# EAGLE design bombhonor (EAGLE 9.5.2)
DATABASE: D:\Alma Automotive s.r.l\Library - Eagle-LIB\database\almadb.txt
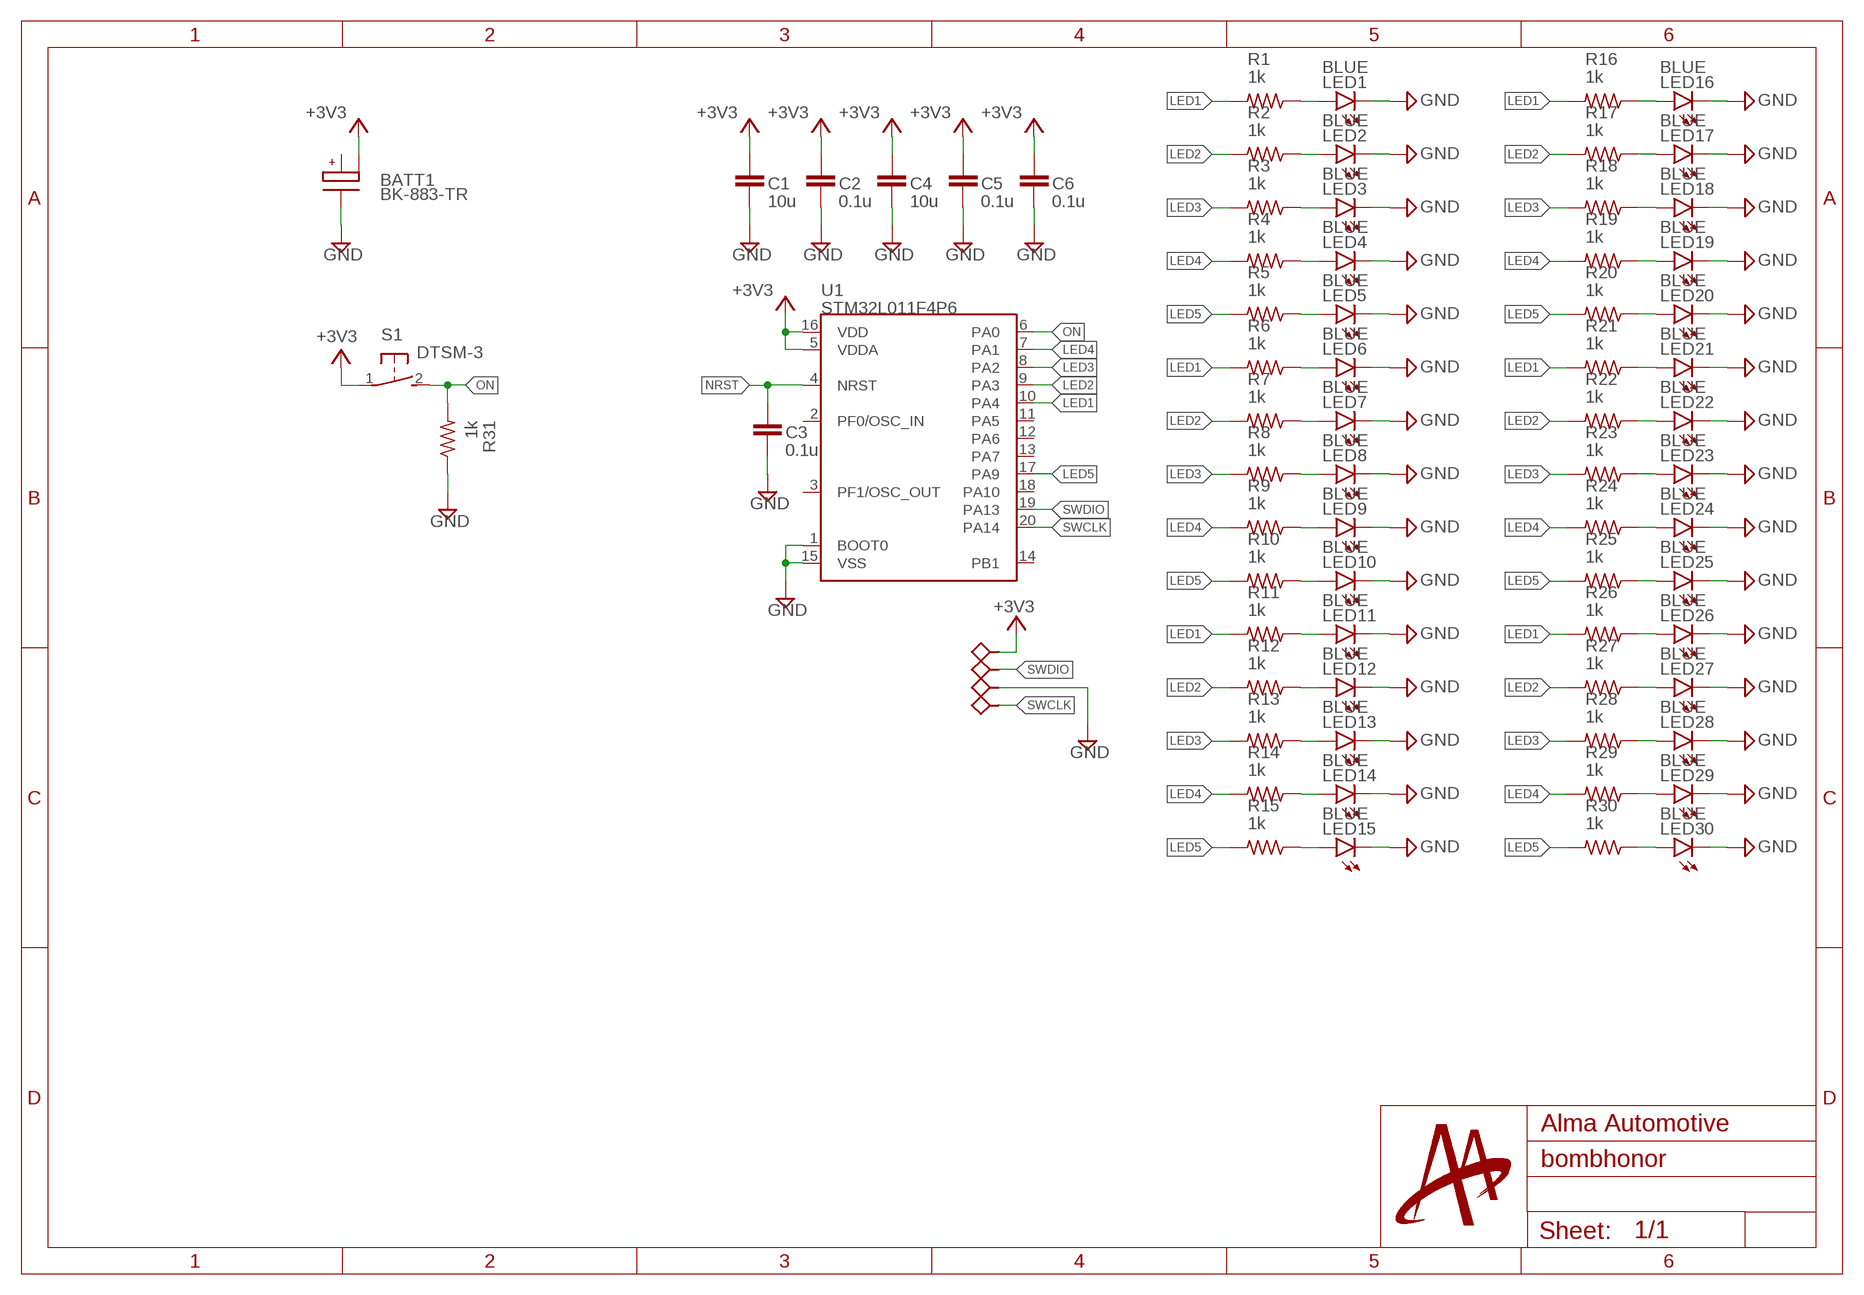
[diagram p0: schematic, sheet 1]

## Parts
BATT1  BK-883-TR  [BK-883-TR]
C1  10u  C0805  [0805[2012]]
C2  0.1u  C0603  [0603[1608]]
C3  0.1u  C0603  [0603[1608]]
C4  10u  C0805  [0805[2012]]
C5  0.1u  C0603  [0603[1608]]
C6  0.1u  C0603  [0603[1608]]
LED1  BLUE  LED_SMD1206  [1206[3216]BOTTOM_ENTRY]
LED2  BLUE  LED_SMD1206  [1206[3216]BOTTOM_ENTRY]
LED3  BLUE  LED_SMD1206  [1206[3216]BOTTOM_ENTRY]
LED4  BLUE  LED_SMD1206  [1206[3216]BOTTOM_ENTRY]
LED5  BLUE  LED_SMD1206  [1206[3216]BOTTOM_ENTRY]
LED6  BLUE  LED_SMD1206  [1206[3216]BOTTOM_ENTRY]
LED7  BLUE  LED_SMD1206  [1206[3216]BOTTOM_ENTRY]
LED8  BLUE  LED_SMD1206  [1206[3216]BOTTOM_ENTRY]
LED9  BLUE  LED_SMD1206  [1206[3216]BOTTOM_ENTRY]
LED10  BLUE  LED_SMD1206  [1206[3216]BOTTOM_ENTRY]
LED11  BLUE  LED_SMD1206  [1206[3216]BOTTOM_ENTRY]
LED12  BLUE  LED_SMD1206  [1206[3216]BOTTOM_ENTRY]
LED13  BLUE  LED_SMD1206  [1206[3216]BOTTOM_ENTRY]
LED14  BLUE  LED_SMD1206  [1206[3216]BOTTOM_ENTRY]
LED15  BLUE  LED_SMD1206  [1206[3216]BOTTOM_ENTRY]
LED16  BLUE  LED_SMD1206  [1206[3216]BOTTOM_ENTRY]
LED17  BLUE  LED_SMD1206  [1206[3216]BOTTOM_ENTRY]
LED18  BLUE  LED_SMD1206  [1206[3216]BOTTOM_ENTRY]
LED19  BLUE  LED_SMD1206  [1206[3216]BOTTOM_ENTRY]
LED20  BLUE  LED_SMD1206  [1206[3216]BOTTOM_ENTRY]
LED21  BLUE  LED_SMD1206  [1206[3216]BOTTOM_ENTRY]
LED22  BLUE  LED_SMD1206  [1206[3216]BOTTOM_ENTRY]
LED23  BLUE  LED_SMD1206  [1206[3216]BOTTOM_ENTRY]
LED24  BLUE  LED_SMD1206  [1206[3216]BOTTOM_ENTRY]
LED25  BLUE  LED_SMD1206  [1206[3216]BOTTOM_ENTRY]
LED26  BLUE  LED_SMD1206  [1206[3216]BOTTOM_ENTRY]
LED27  BLUE  LED_SMD1206  [1206[3216]BOTTOM_ENTRY]
LED28  BLUE  LED_SMD1206  [1206[3216]BOTTOM_ENTRY]
LED29  BLUE  LED_SMD1206  [1206[3216]BOTTOM_ENTRY]
LED30  BLUE  LED_SMD1206  [1206[3216]BOTTOM_ENTRY]
R1  1k  R0603  [0603[1608]]
R2  1k  R0603  [0603[1608]]
R3  1k  R0603  [0603[1608]]
R4  1k  R0603  [0603[1608]]
R5  1k  R0603  [0603[1608]]
R6  1k  R0603  [0603[1608]]
R7  1k  R0603  [0603[1608]]
R8  1k  R0603  [0603[1608]]
R9  1k  R0603  [0603[1608]]
R10  1k  R0603  [0603[1608]]
R11  1k  R0603  [0603[1608]]
R12  1k  R0603  [0603[1608]]
R13  1k  R0603  [0603[1608]]
R14  1k  R0603  [0603[1608]]
R15  1k  R0603  [0603[1608]]
R16  1k  R0603  [0603[1608]]
R17  1k  R0603  [0603[1608]]
R18  1k  R0603  [0603[1608]]
R19  1k  R0603  [0603[1608]]
R20  1k  R0603  [0603[1608]]
R21  1k  R0603  [0603[1608]]
R22  1k  R0603  [0603[1608]]
R23  1k  R0603  [0603[1608]]
R24  1k  R0603  [0603[1608]]
R25  1k  R0603  [0603[1608]]
R26  1k  R0603  [0603[1608]]
R27  1k  R0603  [0603[1608]]
R28  1k  R0603  [0603[1608]]
R29  1k  R0603  [0603[1608]]
R30  1k  R0603  [0603[1608]]
R31  1k  R0603  [0603[1608]]
S1  DTSM-3  [DTSM-3]
TP1  TESTPAD2MM  [TP-2MM]
TP2  TESTPAD2MM  [TP-2MM]
TP3  TESTPAD2MM  [TP-2MM]
TP4  TESTPAD2MM  [TP-2MM]
U1  STM32L011F4P6  STM32F030F4  [TSSOP20]

## Nets
+3V3: BATT1.V+2(V_BATT2) C1.1 C2.1 C4.1 C5.1 C6.1 S1.1 TP1.TP U1.5(VDDA) U1.16(VDD)
GND: BATT1.V-(GND) C1.2 C2.2 C3.2 C4.2 C5.2 C6.2 LED1.K LED2.K LED3.K LED4.K LED5.K LED6.K LED7.K LED8.K LED9.K LED10.K LED11.K LED12.K LED13.K LED14.K LED15.K LED16.K LED17.K LED18.K LED19.K LED20.K LED21.K LED22.K LED23.K LED24.K LED25.K LED26.K LED27.K LED28.K LED29.K LED30.K R31.1 TP3.TP U1.1(BOOT0) U1.15(VSS)
LED1: R1.2 R6.2 R11.2 R16.2 R21.2 R26.2 U1.10(PA4)
LED2: R2.2 R7.2 R12.2 R17.2 R22.2 R27.2 U1.9(PA3)
LED3: R3.2 R8.2 R13.2 R18.2 R23.2 R28.2 U1.8(PA2)
LED4: R4.2 R9.2 R14.2 R19.2 R24.2 R29.2 U1.7(PA1)
LED5: R5.2 R10.2 R15.2 R20.2 R25.2 R30.2 U1.17(PA9)
N$1: LED1.A R1.1
N$2: LED2.A R2.1
N$3: LED3.A R3.1
N$4: LED4.A R4.1
N$5: LED5.A R5.1
N$6: LED6.A R6.1
N$7: LED7.A R7.1
N$8: LED8.A R8.1
N$9: LED9.A R9.1
N$10: LED10.A R10.1
N$11: LED11.A R11.1
N$12: LED12.A R12.1
N$13: LED13.A R13.1
N$14: LED14.A R14.1
N$15: LED15.A R15.1
N$16: LED16.A R16.1
N$17: LED17.A R17.1
N$18: LED18.A R18.1
N$19: LED19.A R19.1
N$20: LED20.A R20.1
N$21: LED21.A R21.1
N$22: LED22.A R22.1
N$23: LED23.A R23.1
N$24: LED24.A R24.1
N$25: LED25.A R25.1
N$26: LED26.A R26.1
N$27: LED27.A R27.1
N$28: LED28.A R28.1
N$29: LED29.A R29.1
N$30: LED30.A R30.1
NRST: C3.1 U1.4(NRST)
ON: R31.2 S1.2 U1.6(PA0)
SWCLK: TP4.TP U1.20(PA14)
SWDIO: TP2.TP U1.19(PA13)
Unconnected: BATT1.V+1(V_BATT1) U1.2(PF0/OSC_IN) U1.3(PF1/OSC_OUT) U1.11(PA5) U1.12(PA6) U1.13(PA7) U1.14(PB1) U1.18(PA10)

## Library data of the parts
BATT1 = AlmaBATT:BK-883-TR; PARTNO: BK-883-TR
C1 C4 = AlmaPASS:C; PARTNO: CL21A106KQCLRNC
C2 C3 C5 C6 = AlmaPASS:C; PARTNO: CL10B104KB8NNNC
LED1-LED30 = AlmaOPTO:LED_SMD; PARTNO: LTST-C230TBKT
R1-R31 = AlmaPASS:R; PARTNO: RMCF0603JT1K00
S1 = switch-tact:DTSM-3; PARTNO: DTSM-3
TP1-TP4 = AlmaCONN:TESTPAD; DNP: T; PARTNO: DNP
U1 = AlmaIC:STM32F030F4; PARTNO: STM32L011F4P6

## Net classes
0 default: width 0.2 mm, drill 0.3 mm

## Board
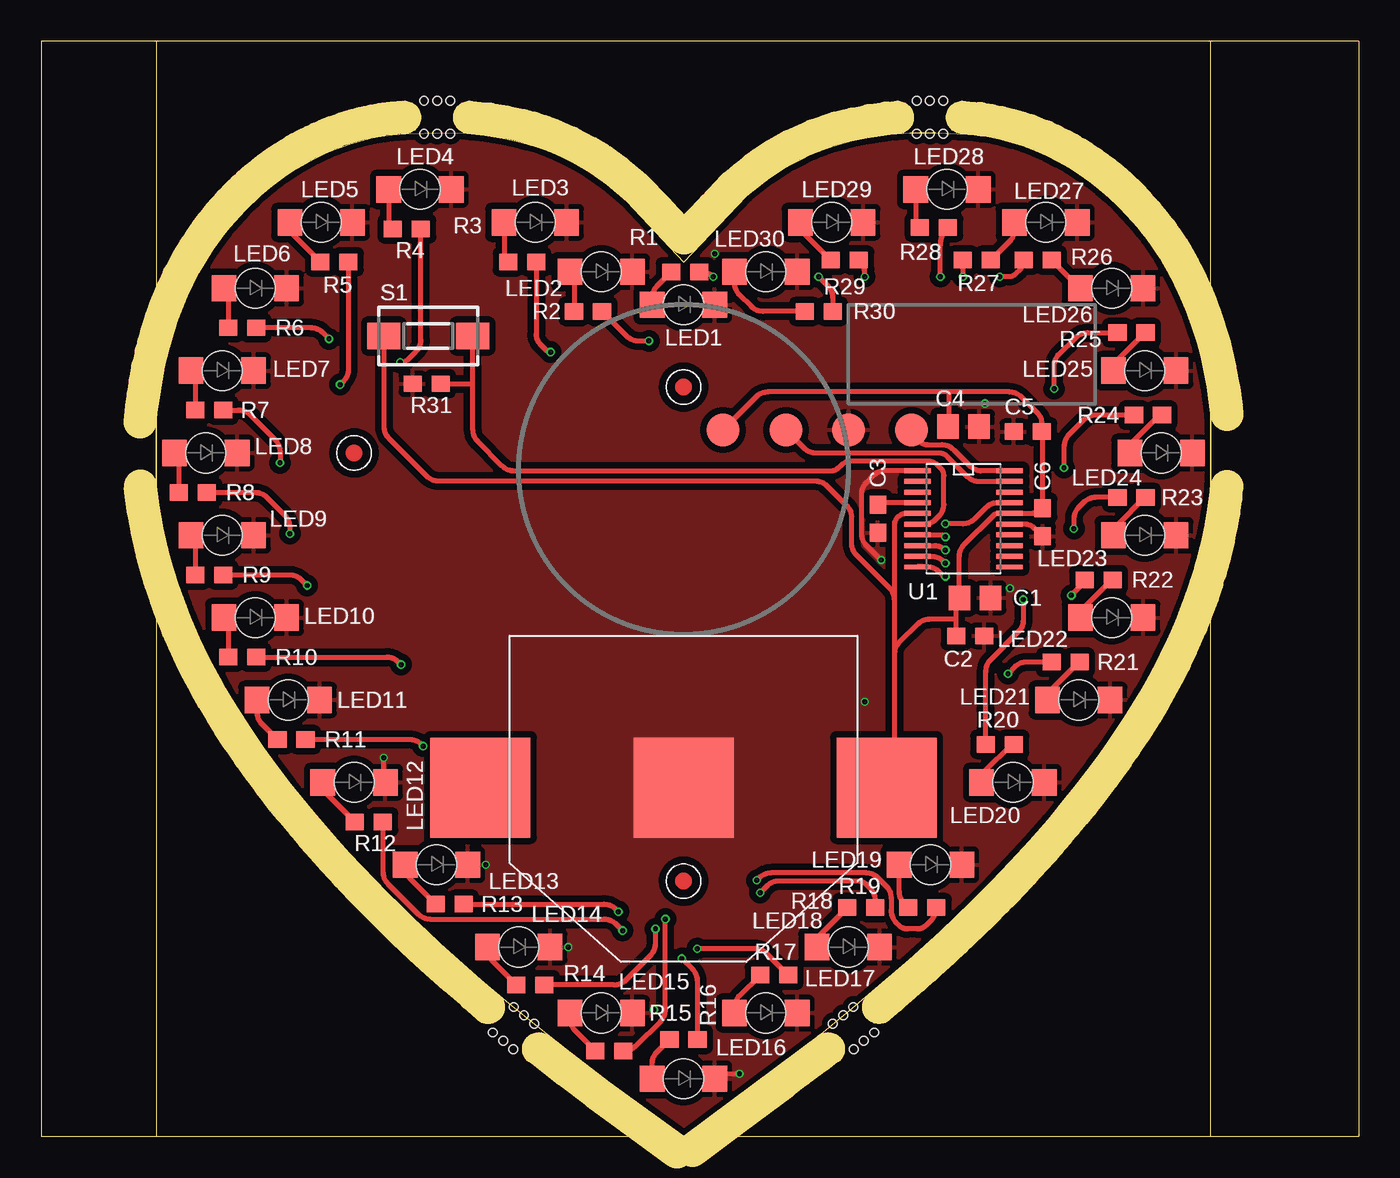
[diagram p1: board, top side]
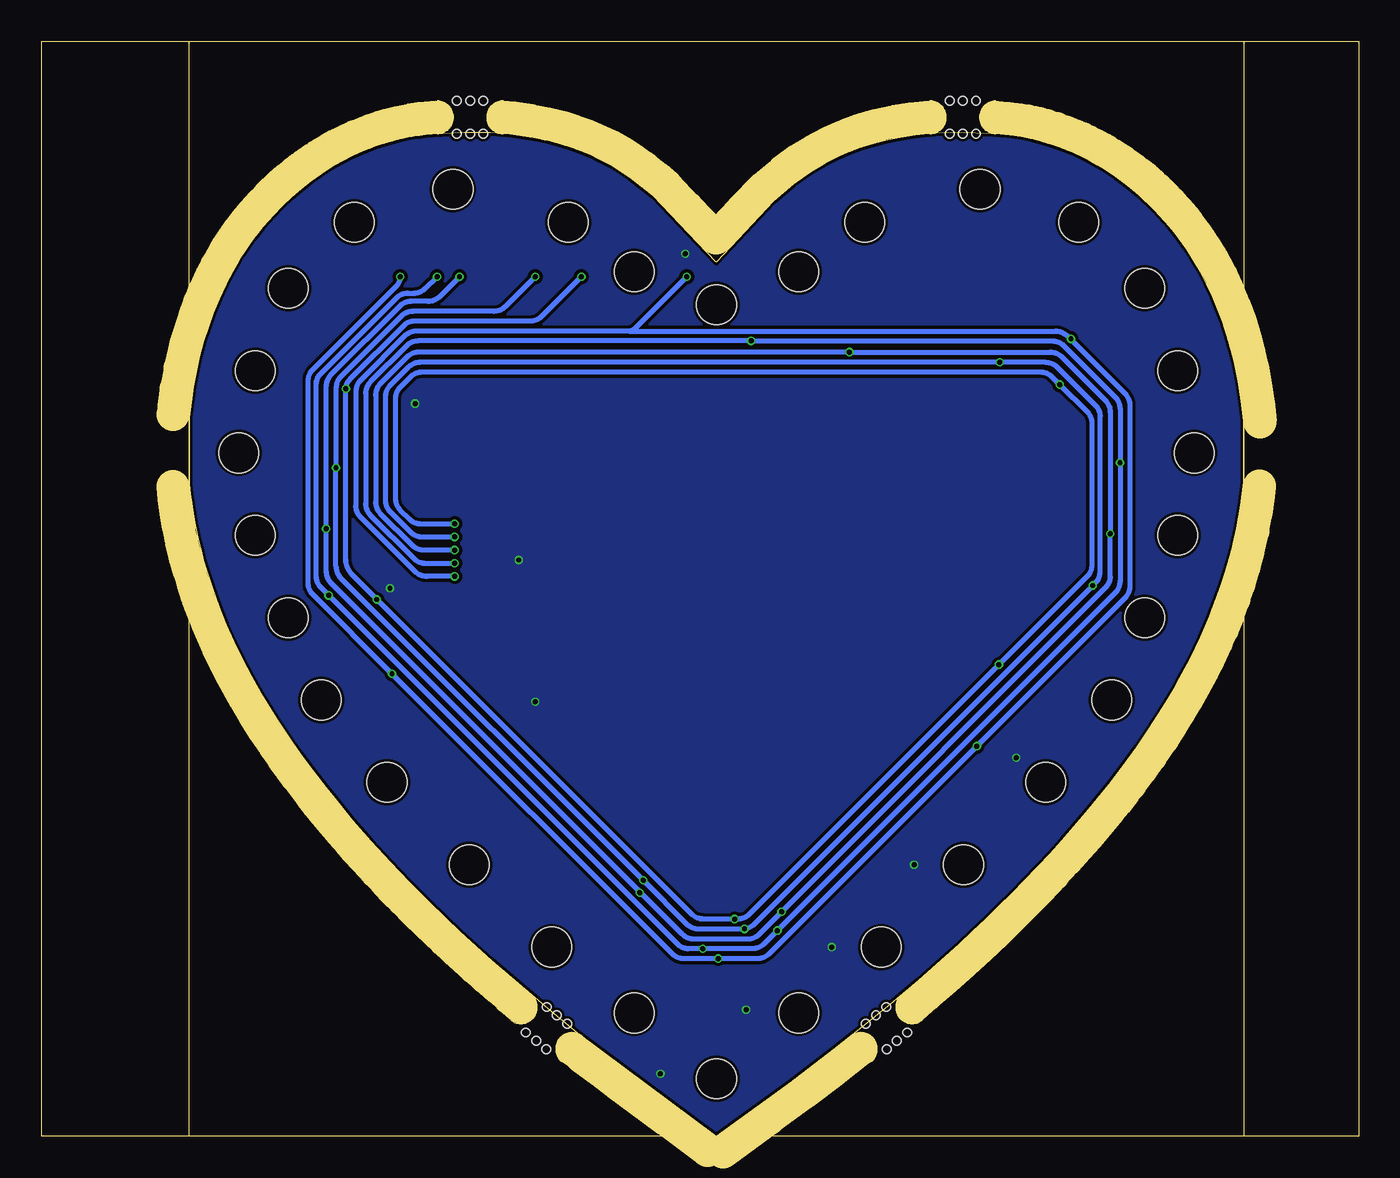
[diagram p2: board, bottom side, seen from below]

Size 80 x 66.5 mm. Coordinates in mm from the lower left corner, seen from the top.
Outline: 21.75,60.85 22.12,60.88 24.34,60.95 25.82,60.9 26.93,60.79 28.03,60.62 28.75,60.47 29.46,60.28 30.17,60.06 30.86,59.8 31.54,59.51 32.21,59.17 32.49,59.02 33.3,58.53 34.34,57.8 35.55,56.79 39.02,53.09 42.85,57.11 44.23,58.19 45.21,58.83 45.55,59.03 45.9,59.23 46.26,59.4 46.61,59.57 46.97,59.73 47.71,60.01 48.45,60.25 49.21,60.45 49.98,60.61 50.76,60.74 51.54,60.84 52.72,60.93 54.3,60.95 56.26,60.85 56.65,60.82 57.02,60.77 57.4,60.72 58.15,60.56 58.89,60.37 59.62,60.14 60.33,59.87 61.03,59.56 61.71,59.22 62.38,58.84 63.02,58.43 63.65,57.98 64.25,57.51 64.83,57.01 65.38,56.49 65.91,55.94 66.23,55.59 66.53,55.23 66.83,54.87 67.11,54.5 67.38,54.12 67.65,53.74 67.9,53.34 68.14,52.95 68.37,52.54 68.59,52.13 68.81,51.72 69.2,50.88 69.55,50.01 69.87,49.13 70.15,48.24 70.39,47.34 70.6,46.42 70.77,45.51 70.9,44.58 71,43.66 71,39.61 70.94,39.02 70.86,38.43 70.78,37.85 70.68,37.27 70.56,36.7 70.44,36.12 70.3,35.55 70.14,34.98 69.98,34.42 69.81,33.86 69.62,33.3 69.22,32.2 68.78,31.11 68.3,30.04 67.78,28.98 67.23,27.94 66.66,26.91 65.74,25.41 64.76,23.94 64.27,23.24 63.76,22.55 63.25,21.87 62.72,21.19 62.19,20.52 61.1,19.21 59.98,17.92 58.82,16.66 57.64,15.42 56.43,14.21 54.58,12.44 52.68,10.71 49.43,7.92 47.45,6.3 39.02,0 34.53,3.26 31.89,5.28 30.14,6.66 28.42,8.06 26.73,9.5 25.06,10.96 24.24,11.71 23.43,12.46 22.62,13.22 21.83,13.99 21.04,14.78 20.27,15.57 19.5,16.37 18.75,17.18 18,18 17.27,18.83 16.55,19.68 15.84,20.53 15.14,21.4 14.3,22.51 13.48,23.64 12.69,24.8 11.93,25.99 11.57,26.59 11.21,27.2 10.87,27.81 10.54,28.43 10.22,29.05 9.91,29.68 9.61,30.31 9.32,30.95 9.05,31.6 8.79,32.25 8.55,32.9 8.32,33.56 8.11,34.23 7.91,34.9 7.73,35.57 7.56,36.25 7.41,36.94 7.28,37.62 7.17,38.32 7.08,39.02 7,39.72 7,43.41 7.13,44.64 7.32,45.86 7.58,47.08 7.89,48.27 8.27,49.45 8.55,50.22 8.87,50.98 9.22,51.73 9.6,52.46 10.01,53.17 10.46,53.87 10.94,54.54 11.21,54.89 11.49,55.24 11.78,55.58 12.07,55.91 12.38,56.23 12.69,56.55 13.02,56.85 13.35,57.15 13.69,57.44 14.03,57.72 14.39,57.99 14.75,58.26 15.12,58.51 15.49,58.75 15.87,58.98 16.26,59.19 16.65,59.4 17.05,59.59 17.46,59.78 17.87,59.95 18.28,60.1 18.7,60.25 19.13,60.38 19.56,60.49 19.99,60.59 20.43,60.68 20.86,60.76 21.31,60.81 21.75,60.85
Outline: 0,0 80,0 80,66.5 0,66.5 0,0
Copper layers (1*16): Top 0.018mm / dielectric 1.55mm / Bottom 0.018mm
Design rules "ALLPCB *": minimum track width 0.3mm, minimum drill 0.3mm, track to track 0.2mm, track to pad 0.2mm, pad to pad 0.2mm, via to via 0.2mm, smd to smd 0mil, copper to edge 0.2mm, drill to drill 0.2mm, minimum pad ring 0.125mm, minimum via ring 0.1mm, stop-mask expansion 2mil, vias tented up to drill 0.45mm, thermal gap 0.3mm
Milling: 200 lines

### Footprints (pad centres in the part's own frame; a part is rotated, then mirrored left to right if it is on the bottom)
MOUSE_BITE_2MM = hole 0.5: 0,1; 0.8,1; -0.8,1; -0.8,-1; 0,-1; 0.8,-1
BK-883-TR = smd 6.07 x 6.07: V+1 -12.33,0.675; V+2 12.33,0.675; V- 0,0.675
0805[2012] = smd 1.3 x 1.5: 1 -0.95,0; 2 0.95,0
0603[1608] = smd 1.1 x 1: 1 -0.85,0; 2 0.85,0
1206[3216]BOTTOM_ENTRY = smd 1.5 x 1.6: A -1.9,0; K 1.9,0 | hole 2.4: 0,0
DTSM-3 = smd 2 x 1.6: 1 -2.7,0; 2 2.7,0
TP-2MM = smd 2 x 2: TP 0,0
TSSOP20 = smd 0.3 x 1.6: 1 -2.925,-2.8; 2 -2.275,-2.8; 3 -1.625,-2.8; 4 -0.975,-2.8; 5 -0.325,-2.8; 6 0.325,-2.8; 7 0.975,-2.8; 8 1.625,-2.8; 9 2.275,-2.8; 10 2.925,-2.8; 11 2.925,2.8; 12 2.275,2.8; 13 1.625,2.8; 14 0.975,2.8; 15 0.325,2.8; 16 -0.325,2.8; 17 -0.975,2.8; 18 -1.625,2.8; 19 -2.275,2.8; 20 -2.925,2.8

### Placement (x,y rotation side)
1  [MOUSE_BITE_2MM]  24.04,61.88 0 top
2  [MOUSE_BITE_2MM]  53.96,61.88 0 top
BATT1  39,20.5 0 top
C1  56.7,32.7 0 top
C2  56.4,30.4 0 top
C3  50.8,37.5 270 top
C4  56,43.1 0 top
C5  59.9,42.8 180 top
C6  60.8,37.3 270 top
LED1  39,50.5 0 top
LED2  34,52.5 0 top
LED3  30,55.5 0 top
LED4  23,57.5 0 top
LED5  17,55.5 0 top
LED6  13,51.5 0 top
LED7  11,46.5 0 top
LED8  10,41.5 0 top
LED9  11,36.5 0 top
LED10  13,31.5 0 top
LED11  15,26.5 0 top
LED12  19,21.5 0 top
LED13  24,16.5 0 top
LED14  29,11.5 0 top
LED15  34,7.5 0 top
LED16  39,3.5 0 top
LED17  44,7.5 0 top
LED18  49,11.5 0 top
LED19  54,16.5 0 top
LED20  59,21.5 0 top
LED21  63,26.5 0 top
LED22  65,31.5 0 top
LED23  67,36.5 0 top
LED24  68,41.5 0 top
LED25  67,46.5 0 top
LED26  65,51.5 0 top
LED27  61,55.5 0 top
LED28  55,57.5 0 top
LED29  48,55.5 0 top
LED30  44,52.5 0 top
R1  39.1,52.5 0 top
R2  33.2,50.1 0 top
R3  29.2,53.1 0 top
R4  22.2,55.1 0 top
R5  17.8,53.1 0 top
R6  12.2,49.1 0 top
R7  10.2,44.1 0 top
R8  9.2,39.1 0 top
R9  10.2,34.1 0 top
R10  12.2,29.1 0 top
R11  15.2,24.1 0 top
R12  19.9,19.1 0 top
R13  24.8,14.1 0 top
R14  29.7,9.2 0 top
R15  34.5,5.2 0 top
R16  39,5.9 0 top
R17  44.5,9.8 0 top
R18  49.8,13.9 0 top
R19  53.5,13.9 0 top
R20  58.2,23.8 180 top
R21  62.2,28.8 180 top
R22  64.2,33.8 180 top
R23  66.2,38.8 180 top
R24  67.2,43.8 180 top
R25  66.2,48.8 180 top
R26  60.5,53.2 180 top
R27  56.8,53.2 180 top
R28  54.2,55.2 0 top
R29  48.8,53.2 0 top
R30  47.2,50.1 0 top
R31  23.4,45.7 0 top
S1  23.5,48.6 0 top
TP1  41.4,42.9 90 top
TP2  45.21,42.9 90 top
TP3  49.02,42.9 90 top
TP4  52.83,42.9 90 top
U1  56,37.5 270 top
U$1  [MOUSE_BITE_2MM]  28.68,6.58 140.8 top
U$2  [MOUSE_BITE_2MM]  49.32,6.58 219.2 top
U$3  [FIDUCIAL_1MM+2MM+CREAM]  39,15.5 0 top
U$4  [FIDUCIAL_1MM+2MM+CREAM]  39,45.5 0 top
U$5  [FIDUCIAL_1MM+2MM+CREAM]  19,41.5 0 top
U$6  [SCRITTA2]  38.5,33.5 0 bottom

### Tracks (layer width: path | path; a pad name or v marks a point on that pad's centre or on a via)
+3V3
  Top 0.3: C2.1 55.55,31.4 | 55.55,31.4 55.55,32.5 C1.1 55.75,35.24 arc-45 56.04,35.94 57.8,37.7 arc-45 58.1,37.83 U1.16 60.06,37.83 arc45 60.77,38.12 C6.1 60.8,42.68 arc-45 C5.1 60.75,43.38 arc45 60.56,43.84 59.49,44.91 arc45 58.79,45.2 55.1,45.2 | TP1.TP 43.41,44.91 arc-45 44.11,45.2 55.1,45.2 | 55.1,45.2 55.1,43.22 arc-45 C4.1 | U1.5 52.54,37.83 arc45 52,37.6 arc45 51.8,37.12 51.8,32.6 | 51.8,32.6 51.8,29.29 | 51.8,29.29 51.8,21.64 BATT1.V+2 | 55.55,31.4 53.91,31.4 arc45 53.21,31.11 52.09,29.99 arc45 51.8,29.29 | 51.8,32.6 arc45 51.52,33.28 49.49,35.31 arc-45 49.2,36.01 49.2,37.6 arc45 48.92,38.28 47.69,39.51 arc45 46.99,39.8 24.11,39.8 arc-45 23.41,40.09 21.09,42.41 arc-45 20.8,43.11 S1.1
GND  (via drill 0.3)
  Top 0.3: C6.2 60.37,36.88 arc45 59.66,37.17 U1.15 | U1.1 51.24,40.42 arc45 50.53,40.13 50.09,39.69 arc45 49.8,38.99 49.8,36.61 arc45 50.09,35.91 v51,35 | LED12.K arc-45 20.8,21.74 v20.8,23 | LED16.K LED16.K arc-45 41.61,3.8 v42.4,3.8
  other vias: 27,16.5 32,11.5 57.3,44.5 58.82,33.28 40.9,53.6 50,26.4 37.2,7.7
  pour Top (isolate 0.4): 3,-0.5 3,65.5 73,65.5 73,-0.5
  pour Bottom (no thermals): 73,-0.5 73,63.5 3,63.5 3,-0.5
LED1  (via drill 0.3)
  Top 0.3: R11.2 22.37,24.1 arc-45 23.08,23.81 v23.18,23.7 | R16.2 39.85,9.44 arc45 39.56,10.14 v38.9,10.8 | R21.2 59.81,28.8 arc45 59.11,28.51 v58.7,28.1 | v17.48,48.42 17.09,48.81 arc45 16.39,49.1 R6.2 | v54.9,34 arc-45 54.73,34.07 54.5,34.3 arc45 53.84,34.58 U1.10 | R26.2 arc-45 59.4,52.6 59.2,52.4 arc-45 58.72,52.2 v58.2,52.2 | R1.2 40.09,52.5 arc-45 v40.79,52.21 v40.8,52.2
  Bottom 0.3: v40.8,52.2 43.95,49.05 arc45 44.31,48.9 | 23.2,23.7 14.19,32.71 arc-45 13.9,33.41 13.9,44.39 arc-45 14.19,45.09 17.56,48.46 | 23.2,23.7 35.81,11.09 arc45 36.51,10.8 v38.9,10.8 40.99,10.8 arc45 41.69,11.09 v58.7,28.1 63.51,32.91 arc45 63.8,33.61 63.8,45.85 arc45 63.51,46.56 58.44,51.63 arc-45 v58.2,52.2 | 23.2,23.7 v23.18,23.7 | 44.31,48.9 18.41,48.9 arc45 17.71,48.61 17.56,48.46 | 17.56,48.46 arc-45 v17.48,48.42 | v54.9,34 56.59,34 arc45 57.29,34.29 60.61,37.61 arc45 60.9,38.31 60.9,45.21 arc45 60.61,45.92 57.92,48.61 arc45 57.21,48.9 44.31,48.9
LED2  (via drill 0.3)
  Top 0.3: R22.2 63.3,33.8 arc-45 63.16,33.46 v62.55,32.85 | R17.2 44.04,11.11 arc45 43.34,11.4 v39.83,11.4 | R12.2 20.75,16.06 arc45 21.04,15.36 22.91,13.49 arc45 23.61,13.2 34.19,13.2 arc-45 34.89,12.91 v35.3,12.5 | R7.2 11.99,44.1 arc-45 12.69,43.81 14.21,42.29 arc-45 14.5,41.59 v14.5,40.9 | R2.2 35.56,48.59 arc45 36.26,48.3 v36.9,48.3 | U1.9 54.06,35.23 arc-45 54.77,34.93 v54.9,34.8 | R27.2 55.95,52.73 arc45 55.96,52.69 v55.96,52.2
  Bottom 0.3: 40.69,11.4 arc45 41.39,11.69 | 41.39,11.69 v62.55,32.85 63.01,33.31 arc45 63.3,34.01 63.3,45.64 arc45 63.01,46.35 58.45,50.91 arc45 57.74,51.2 57.38,51.2 arc-45 56.67,51.49 v55.96,52.2 | 41.39,11.69 arc-45 40.69,11.4 | 40.69,11.4 v39.83,11.4 36.81,11.4 arc-45 36.11,11.69 v35.3,12.5 14.79,33.01 arc-45 14.5,33.71 v14.5,40.9 14.5,44.19 arc-45 14.79,44.89 17.91,48.01 arc-45 18.61,48.3 v36.9,48.3 57.11,48.3 arc-45 57.81,48.01 60.01,45.81 arc-45 60.3,45.11 60.3,38.42 arc-45 60.01,37.71 57.39,35.09 arc-45 56.68,34.8 v54.9,34.8
LED3  (via drill 0.3)
  Top 0.3: R28.2 arc45 54.6,54.11 v54.6,52.2 | R23.2 64.01,38.8 arc45 63.31,38.51 62.99,38.19 arc45 62.7,37.49 v62.7,36.9 | R18.2 50.65,14.34 arc45 50.36,15.04 50.1,15.3 arc45 49.62,15.5 44.77,15.5 arc45 44.06,15.21 v43.65,14.8 | R13.2 34.19,14.1 arc-45 34.89,13.81 v35.05,13.65 | R8.2 12.99,39.1 arc-45 13.69,38.81 14.81,37.69 arc-45 15.1,36.99 v15.1,36.6 | v30.93,47.63 arc-45 30.67,47.73 30.3,48.1 arc-45 30.05,48.7 R3.2 | U1.8 54.24,35.88 arc-45 v54.9,35.6
  Bottom 0.3: 43.69,14.89 62.41,33.61 arc45 62.7,34.31 v62.7,36.9 62.7,45.54 arc45 62.41,46.24 58.24,50.41 arc45 57.54,50.7 56.51,50.7 arc-45 55.81,50.99 v54.6,52.2 | 43.69,14.89 41.09,12.29 arc-45 40.39,12 37.01,12 arc-45 36.48,12.22 v35.05,13.65 15.39,33.31 arc-45 15.1,34.01 v15.1,36.6 15.1,43.99 arc-45 15.39,44.69 18.03,47.33 arc-45 18.74,47.63 v30.93,47.63 57.07,47.63 arc-45 57.78,47.33 59.41,45.71 arc-45 59.7,45 59.7,38.53 arc-45 59.41,37.82 57.48,35.89 arc-45 56.77,35.6 v54.9,35.6 | v43.65,14.8 arc-45 43.69,14.89
LED4  (via drill 0.3)
  Top 0.3: R24.2 64.01,43.8 arc45 63.31,43.51 62.39,42.59 arc45 62.1,41.89 v62.1,40.6 | R19.2 54.35,13.86 arc-45 54.06,13.16 53.7,12.8 arc-45 53.22,12.6 52.6,12.6 arc-45 52.09,12.81 51.89,13.01 arc-45 51.6,13.71 51.6,14.49 arc45 51.31,15.19 50.79,15.71 arc45 50.09,16 44.31,16 arc45 43.61,15.71 v43.45,15.55 | R9.2 15.09,34.1 arc-45 15.79,33.81 v16.15,33.45 | R14.2 34.79,9.2 arc45 35.49,9.49 37.01,11.01 arc45 37.3,11.71 v37.3,12.6 | U1.7 54.6,36.52 arc-45 v54.9,36.4 | v50,52.2 50,52.44 arc45 49.71,53.14 R29.2 | v21.8,47 arc45 22.31,47.21 22.76,47.66 arc45 23.05,48.36 R4.2
  Bottom 0.3: 37.41,12.6 arc-45 36.71,12.89 v16.15,33.45 15.99,33.61 arc-45 15.7,34.31 15.7,43.69 arc-45 15.99,44.39 18.31,46.71 arc-45 19.01,47 v21.8,47 56.99,47 arc-45 57.7,46.71 58.81,45.6 arc-45 59.1,44.89 59.1,38.64 arc-45 58.81,37.93 57.57,36.69 arc-45 56.86,36.4 v54.9,36.4 | 37.41,12.6 40.09,12.6 arc45 40.79,12.89 v43.45,15.55 61.81,33.91 arc45 62.1,34.61 v62.1,40.6 62.1,45.43 arc45 61.81,46.14 58.14,49.81 arc45 57.43,50.1 52.51,50.1 arc-45 51.81,50.39 v50,52.2 | v37.3,12.6 37.41,12.6
LED5  (via drill 0.3)
  Top 0.3: R15.2 35.39,5.2 arc45 36.09,5.49 37.61,7.01 arc45 37.9,7.71 v37.9,13.2 | v59.63,32.6 59.63,31.34 arc-45 59.33,30.63 57.64,28.94 arc45 57.35,28.24 R20.2 | v61.5,45.4 61.5,46.79 arc-45 61.79,47.49 62.81,48.51 arc-45 63.51,48.8 R25.2 | v21.85,28.65 21.69,28.81 arc45 20.99,29.1 R10.2 | v18.15,45.65 18.36,45.86 arc45 18.65,46.56 R5.2 | v54.9,37.2 55.97,37.2 arc45 56.67,37.49 57.36,38.18 arc-45 58.07,38.48 U1.17 | v47.2,52.2 47.76,51.64 arc-45 48.05,50.94 R30.2
  Bottom 0.3: 59.75,32.75 61.14,34.14 arc45 61.5,35.01 v61.5,45.4 arc45 61.26,45.97 58.03,49.21 arc45 57.32,49.5 50.31,49.5 arc-45 49.61,49.79 v47.2,52.2 | 59.75,32.75 59.63,32.7 arc-45 v59.63,32.6 | 59.75,32.75 40.49,13.49 arc-45 39.79,13.2 v37.9,13.2 37.71,13.2 arc-45 37.01,13.49 v21.85,28.65 16.49,34.01 arc-45 16.2,34.71 16.2,43.29 arc-45 16.49,43.99 v18.15,45.65 18.61,46.11 arc-45 19.31,46.4 56.89,46.4 arc-45 57.59,46.11 58.21,45.49 arc-45 58.5,44.79 58.5,38.74 arc-45 58.21,38.04 57.66,37.49 arc-45 56.96,37.2 v54.9,37.2
N$1
  Top 0.3: R1.1 37.39,51.64 arc45 37.1,50.94 LED1.A
N$2
  Top 0.3: LED2.A 32.35,52.25 R2.1
N$3
  Top 0.3: LED3.A 28.1,53.35 R3.1
N$4
  Top 0.3: LED4.A 21.1,55.35 R4.1
N$5
  Top 0.3: LED5.A 15.1,54.95 R5.1
N$6
  Top 0.3: LED6.A 11.35,51.25 R6.1
N$7
  Top 0.3: LED7.A arc-45 9.35,45.9 R7.1
N$8
  Top 0.3: LED8.A arc-45 8.35,40.9 R8.1
N$9
  Top 0.3: LED9.A arc-45 9.35,35.9 R9.1
N$10
  Top 0.3: LED10.A arc-45 11.35,30.9 R10.1
N$11
  Top 0.3: LED11.A 13.1,25.76 arc45 13.39,25.06 R11.1
N$12
  Top 0.3: LED12.A 17.1,21.46 arc45 17.39,20.76 R12.1
N$13
  Top 0.3: LED13.A 22.1,16.36 arc45 22.39,15.66 R13.1
N$14
  Top 0.3: LED14.A 27.1,11.36 arc45 27.39,10.66 R14.1
N$15
  Top 0.3: LED15.A 32.1,7.16 arc45 32.39,6.46 R15.1
N$16
  Top 0.3: LED16.A 37.1,4.44 arc-45 37.39,5.14 R16.1
N$17
  Top 0.3: LED17.A 42.1,7.84 arc-45 42.39,8.54 R17.1
N$18
  Top 0.3: LED18.A 47.1,11.64 arc-45 47.39,12.34 R18.1
N$19
  Top 0.3: R19.1 52.39,14.16 arc-45 52.1,14.86 LED19.A
N$20
  Top 0.3: LED20.A 57.1,21.59 arc-45 57.39,22.29 58.79,23.69 arc-45 R20.1
N$21
  Top 0.3: LED21.A arc-45 61.38,27.18 62.97,28.77 arc-45 R21.1
N$22
  Top 0.3: LED22.A arc-45 63.38,32.18 64.97,33.77 arc-45 R22.1
N$23
  Top 0.3: LED23.A arc-45 65.38,37.18 66.97,38.77 arc-45 R23.1
N$24
  Top 0.3: LED24.A 66.1,41.59 arc-45 66.39,42.29 67.79,43.69 arc-45 R24.1
N$25
  Top 0.3: LED25.A arc-45 65.38,47.18 66.97,48.77 arc-45 R25.1
N$26
  Top 0.3: LED26.A arc-45 63.02,51.53 R26.1
N$27
  Top 0.3: LED27.A 59.1,55.06 arc-45 58.81,54.36 R27.1
N$28
  Top 0.3: LED28.A 53.1,55.8 arc45 R28.1
N$29
  Top 0.3: LED29.A 46.1,55.46 arc45 46.39,54.76 R29.1
N$30
  Top 0.3: R30.1 43.81,50.1 arc-45 43.11,50.39 42.39,51.11 arc-45 42.1,51.81 LED30.A
NRST
  Top 0.3: U1.4 50.92,38.48 C3.1
ON
  Top 0.3: 26.2,45.7 26.2,42.91 arc45 26.49,42.21 28.01,40.69 arc45 28.71,40.4 47.92,40.4 arc45 48.4,40.6 48.51,40.71 arc-45 49.21,41 53.79,41 arc-45 54.49,40.71 54.6,40.6 arc-45 54.8,40.12 54.8,38.36 arc-45 54.51,37.66 54.32,37.47 arc-45 53.61,37.17 U1.6 | 26.2,45.7 S1.2 | R31.2 26.2,45.7
SWCLK
  Top 0.3: U1.20 57.09,40.42 arc-45 56.38,40.72 55.39,41.71 arc45 54.69,42 53.8,42 arc-45 53.34,42.19 52.83,42.7 TP4.TP
SWDIO
  Top 0.3: TP2.TP 46.32,41.79 arc45 47.02,41.5 54.49,41.5 arc-45 55.02,41.28 56.23,40.07 arc45 56.94,39.77 U1.19

### Text on the board
bStop: 11.09.2021
_tNames: LED4 | LED28 | LED5 | LED3 | LED29 | LED27 | R3 | R1 | LED30 | LED6 | R4 | R28 | R26 | R27 | R5 | S1 | LED2 | R29 | R2 | R30 | R6 | LED26 | LED1 | R25 | LED7 | LED25 | R7 | R31 | C4 | C5 | R24 | LED8 | C3 | C6 | R8 | LED24 | R23 | LED9 | LED23 | R9 | U1 | R22 | C1 | LED10 | LED22 | R10 | C2 | R21 | LED11 | LED21 | R20 | R11 | LED12 | LED20 | R12 | LED19 | LED13 | R19 | R13 | R18 | LED14 | LED18 | R17 | R14 | LED15 | LED17 | R15 | R16 | LED16